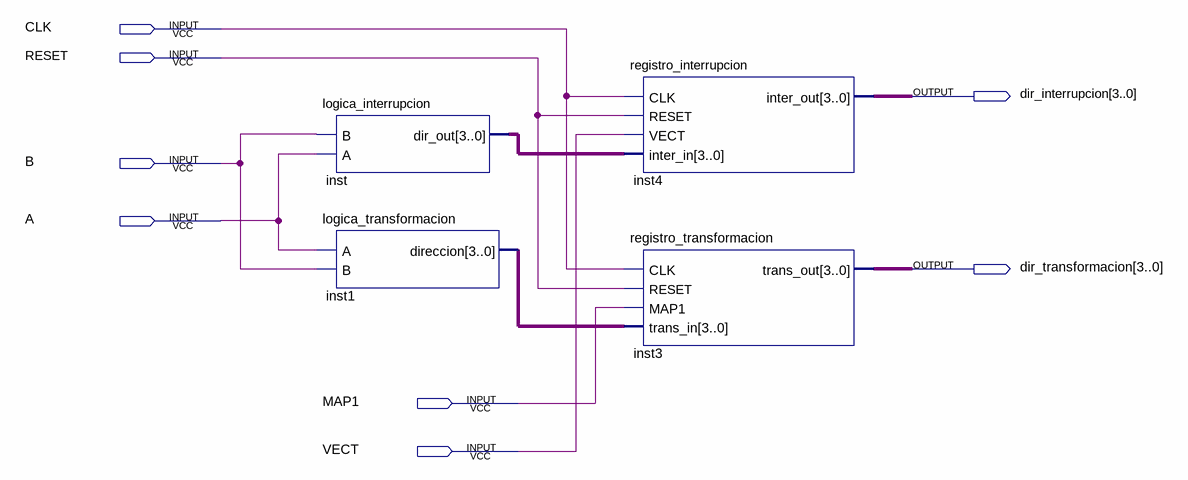
[diagram p0: schematic sheet]
// Quartus schematic interr_trans.bdf as structural Verilog: 4 symbols, 8 pins
module interr_trans (
  input  CLK,
  input  RESET,
  input  B,
  input  A,
  input  MAP1,
  input  VECT,
  output [3:0] dir_interrupcion,
  output [3:0] dir_transformacion
);

  wire [3:0] inst1_direccion, inst_dir_out;

  logica_interrupcion inst (.B(B), .A(A), .dir_out(inst_dir_out));
  logica_transformacion inst1 (.A(A), .B(B), .direccion(inst1_direccion));
  registro_interrupcion inst4 (
    .CLK(CLK), .RESET(RESET), .VECT(VECT), .inter_in(inst_dir_out), .inter_out(dir_interrupcion));
  registro_transformacion inst3 (
    .CLK(CLK), .RESET(RESET), .MAP1(MAP1), .trans_in(inst1_direccion), .trans_out(dir_transformacion));
endmodule
